# EAGLE design FETishOnAStick (EAGLE 7.4.0)
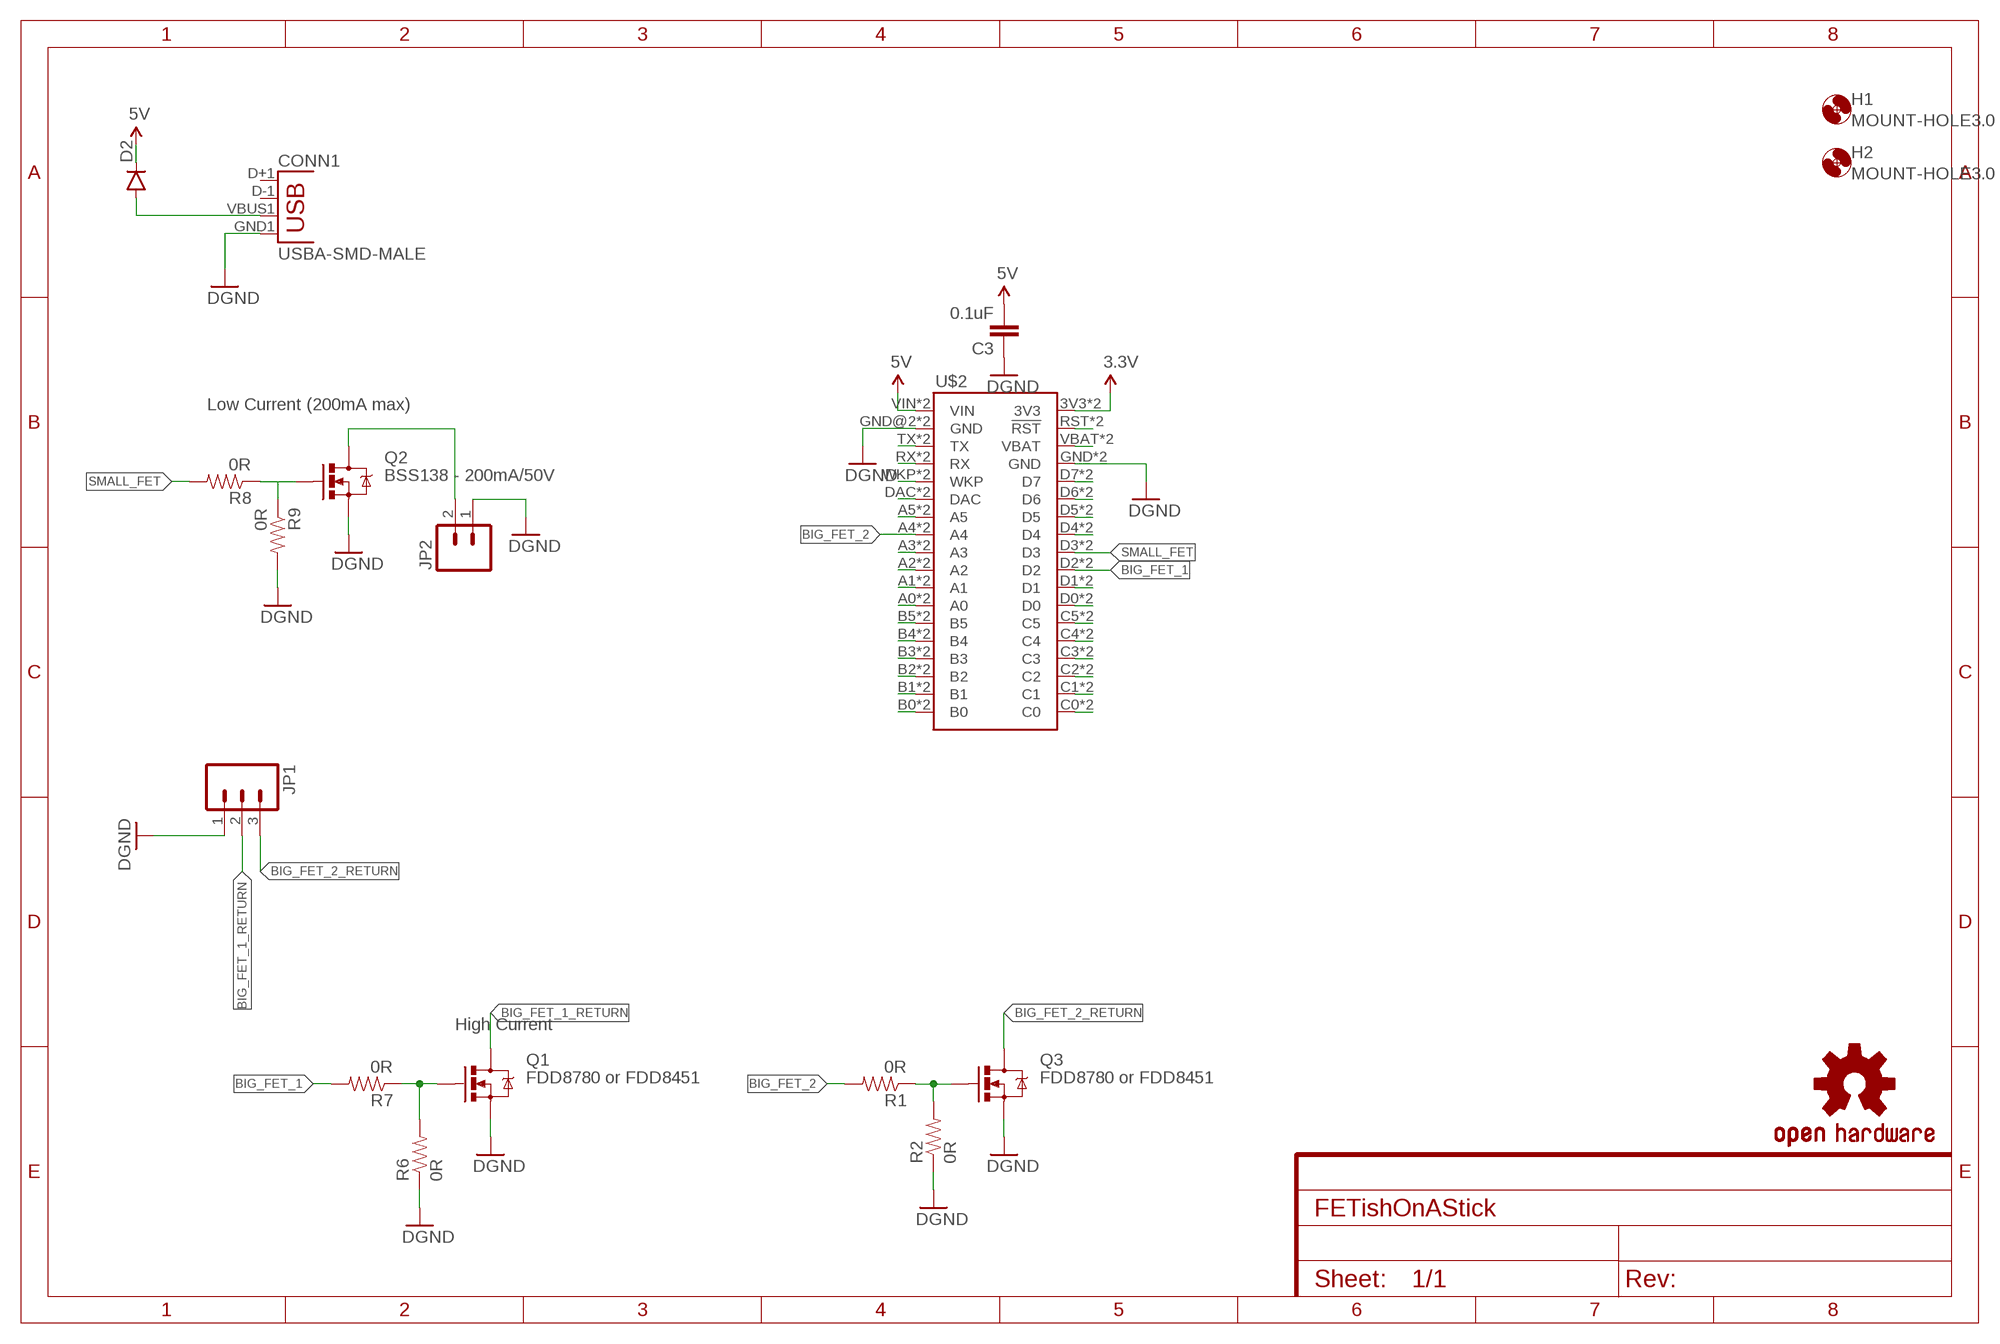
[diagram p0: schematic, sheet 1]

## Parts
C3  0.1uF  CAP0805  [0805]
CONN1  USBA-SMD-MALE  [USB-A-SMT-MALE]
D2  DIODESMA  [SMA-DIODE]
H1  MOUNT-HOLE3.0  [3,0]
H2  MOUNT-HOLE3.0  [3,0]
JP1  M03-SCREW-5MM  [SCREWTERMINAL-5MM-3]
JP2  M02POLAR  [MOLEX-1X2]
LOGO2  OSHW-LOGOS  [OSHW-LOGO-S]
Q1  FDD8780 or FDD8451  MOSFET-NCHANNELFDD8780  [DPAK]
Q2  BSS138 - 200mA/50V  MOSFET-NCHANNELBSS138  [SOT23-3]
Q3  FDD8780 or FDD8451  MOSFET-NCHANNELFDD8780  [DPAK]
R1  0R  RESISTOR0805-RES  [0805]
R2  0R  RESISTOR0805-RES  [0805]
R6  0R  RESISTOR0805-RES  [0805]
R7  0R  RESISTOR0805-RES  [0805]
R8  0R  RESISTOR0805-RES  [0805]
R9  0R  RESISTOR0805-RES  [0805]
U$2  ELECTRONDUALNAMED  [ELECTRON_SIMPLE_SILK_NAMES_DUAL]

## Nets
3.3V: U$2.3V3 U$2.3V3_1(3V3)
5V: C3.2 D2.C U$2.VIN U$2.VIN_1B(VIN)
BIG_FET_1: R7.2 U$2.D2 U$2.D2_1(D2)
BIG_FET_1_RETURN: JP1.2 Q1.4(D)
BIG_FET_2: R1.2 U$2.A4 U$2.A4_1(A4)
BIG_FET_2_RETURN: JP1.3 Q3.4(D)
GND: C3.1 CONN1.GND1(GND) JP1.1 JP2.1 Q1.3(S) Q2.2(S) Q3.3(S) R2.1 R6.1 R9.2 U$2.GND U$2.GND@2(GND) U$2.GND_1(GND) U$2.GND_1B(GND) ; supply symbol labelled DGND
N$1: CONN1.VBUS1(VBUS) D2.A
N$3: Q3.1(G) R1.1 R2.2
N$6: U$2.VBAT U$2.VBATT_1(VBAT)
N$7: U$2.RST(!RST) U$2.RST_1(!RST)
N$11: U$2.D7 U$2.D7_1(D7)
N$13: Q2.1(G) R8.1 R9.1
N$15: U$2.D6 U$2.D6_1(D6)
N$16: U$2.D5 U$2.D5_1(D5)
N$20: U$2.D4 U$2.D4_1(D4)
N$23: U$2.C5 U$2.C5_1(C5)
N$24: U$2.C4 U$2.C4_1(C4)
N$25: U$2.C3 U$2.C3_1(C3)
N$26: U$2.C2 U$2.C2_1(C2)
N$27: Q1.1(G) R6.2 R7.1
N$28: U$2.C1 U$2.C1_1(C1)
N$29: U$2.C0 U$2.C0_1(C0)
N$31: U$2.B0 U$2.B0_1(B0)
N$33: U$2.B1 U$2.B1_1(B1)
N$35: U$2.B2 U$2.B2_1(B2)
N$36: U$2.B3 U$2.B3_1(B3)
N$37: U$2.B4 U$2.B4_1(B4)
N$38: U$2.B5 U$2.B5_1(B5)
N$39: U$2.A0 U$2.A0_1(A0)
N$40: U$2.A1 U$2.A1_1(A1)
N$41: U$2.A2 U$2.A2_1(A2)
N$42: U$2.A3 U$2.A3_1(A3)
N$44: U$2.A5 U$2.A5_1(A5)
N$45: U$2.DAC U$2.DAC_1(DAC)
N$46: U$2.WKP U$2.WKP_1(WKP)
N$47: U$2.RX U$2.RX_1(RX)
N$48: U$2.TX U$2.TX_1(TX)
SCL: U$2.D1 U$2.D1_1(D1)
SDA: U$2.D0 U$2.D0_1(D0)
SMALL_FET: R8.2 U$2.D3 U$2.D3_1(D3)
SMALL_FET_RETURN: JP2.2 Q2.3(D)
Unconnected: CONN1.D+1(D+) CONN1.D-1(D-)

## Notes on the sheet
- Low Current (200mA max)
- High Current

## Library data of the parts
C3 = SparkFun-Passives:CAP: Capacitor Standard 0603 ceramic capacitor, and 0.1" leaded capacitor.
CONN1 = SparkFun-Connectors:USB: USB Connectors USB-B-PTH is fully proven SKU : PRT-00139/CONN-08278 USB-miniB is fully proven SKU : PRT-00587 USB-A-PCB is untested. USB-A-H is throughly reviewed, but untested. Spark Fun Electronics SKU : PRT-00437 USB-B-SMT is throughly reviewed, but untested. Needs silkscreen touching up. USB-A-S has not been used/tested USB-MB-H has not been used/tested USB-MICROB has been used. CONN-09505
D2 = SparkFun-DiscreteSemi:DIODE: Diode These are standard reverse protection diodes and small signal diodes. SMA package can handle up to about 1A. SOD-323 can handle about 200mA. What the SOD-323 package when ordering, there are some mfgs out there that are 5-pin packages.
H1 H2 = holes:MOUNT-HOLE: MOUNTING HOLE with drill center marker
JP1 = SparkFun-Connectors:M03: Header 3 Standard 3-pin 0.1" header. Use with straight break away headers (SKU : PRT-00116), right angle break away headers (PRT-00553), swiss pins (PRT-00743), machine pins (PRT-00117), and female headers (PRT-00115). Molex polarized connector foot print use with SKU : PRT-08232 with associated crimp pins and housings.; STOREFRONT_ID: PRT-08433
JP2 = SparkFun-Connectors:M02: Standard 2-pin 0.1" header. Use with - straight break away headers ( PRT-00116) - right angle break away headers (PRT-00553) - swiss pins (PRT-00743) - machine pins (PRT-00117) - female headers (PRT-00115) Molex polarized connector foot print use with: PRT-08233 with associated crimp pins and housings. 2.54_SCREWTERM for use with PRT-10571. 3.5mm Screw Terminal footprints for PRT-08084 5mm Screw Terminal footprints for use with PRT-08432
LOGO2 = SparkFun-Aesthetics:OSHW-LOGO: Open Source Hardware Logo This logo indicates the piece of hardware it is found on incorporates a OSHW license and/or adheres to the definition of open source hardware found here: http://freedomdefined.org/OSHW
Q1 Q3 = SparkFun-DiscreteSemi:MOSFET-NCHANNEL: Common NMOSFET Parts MFG P/N Store ID Prod ID FDD8780 TRANS-09984 SI7820DN TRANS-11055 FDS6630A IC-08089 2N7002PW TRANS-11151 FQP30N06L COM-10213 TRANS-10060 BSS123LT1G TRANS-08345 BSS138 TRANS-00830 BS170 2N7000; PROD_ID: TRANS-09984
Q2 = SparkFun-DiscreteSemi:MOSFET-NCHANNEL: Common NMOSFET Parts MFG P/N Store ID Prod ID FDD8780 TRANS-09984 SI7820DN TRANS-11055 FDS6630A IC-08089 2N7002PW TRANS-11151 FQP30N06L COM-10213 TRANS-10060 BSS123LT1G TRANS-08345 BSS138 TRANS-00830 BS170 2N7000; PROD_ID: TRANS-00830; VALUE: 200mA/50V
R1 R2 R6-R9 = SparkFun-Resistors:RESISTOR: Resistor Basic schematic elements and footprints for 0603, 1206, and PTH resistors.
U$2 = Tinamous:ELECTRON

## Board
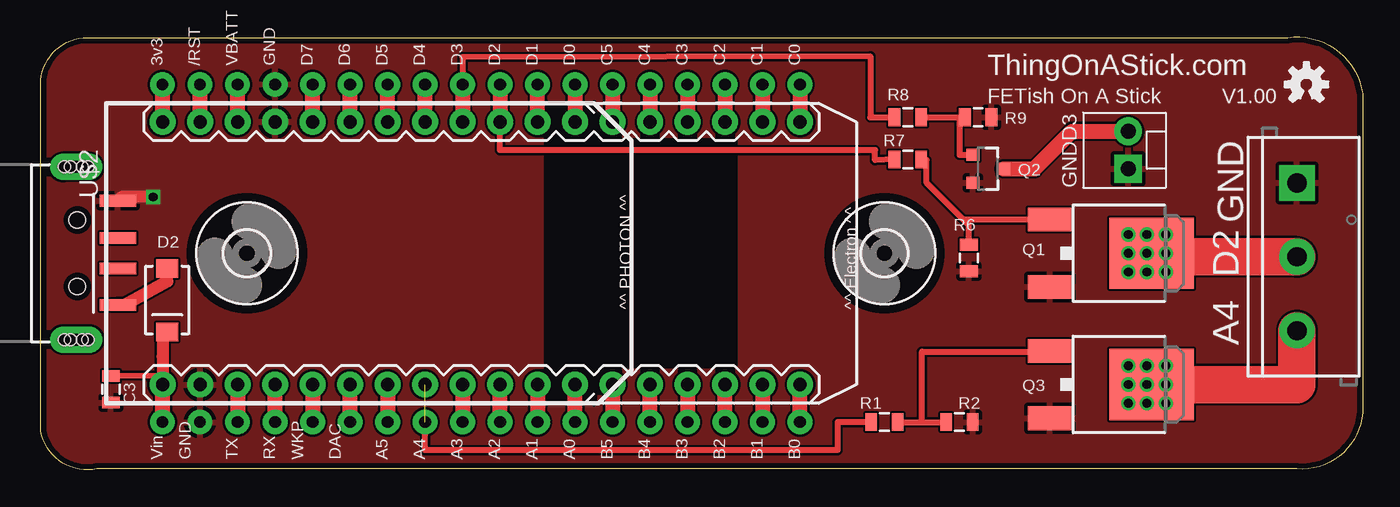
[diagram p1: board, top side]
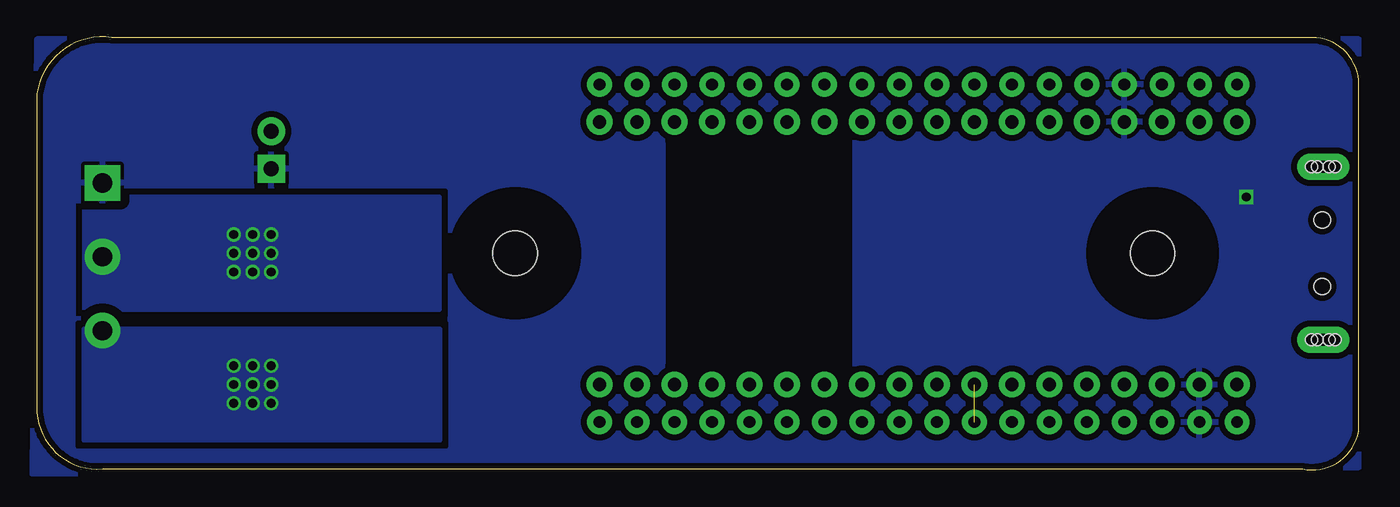
[diagram p2: board, bottom side, seen from below]

Size 89.54 x 29.31 mm. Coordinates in mm from the lower left corner, seen from the top.
Outline: 3.17,29.27 84.45,29.27 arc-90 89.54,25.46 89.54,3.87 arc-90 85.09,0.06 3.81,0.06 arc-90 0,2.6 0,26.1 arc-90 3.17,29.27
Copper layers (1*16): Top 0.0356mm / dielectric 1.5011mm / Bottom 0.0356mm
Design rules "OSHPark": minimum track width 6mil, minimum drill 13mil, track to track 6mil, track to pad 6mil, pad to pad 6mil, via to via 6mil, smd to smd 6mil, copper to edge 15mil, drill to drill 6mil, minimum pad ring 7mil, minimum via ring 7mil, stop-mask expansion 3mil, vias tented up to drill 0mil, thermal gap 10mil
tRestrict: area 34.3,4.5 to 47,24.8
bRestrict: area 34.9,4.5 to 46.4,24.8

### Footprints (pad centres in the part's own frame; a part is rotated, then mirrored left to right if it is on the bottom)
0805 = smd 0.8 x 1.2: 1 -0.9,0; 2 0.9,0
USB-A-SMT-MALE = smd 0.8 x 2.5: D+1 1.027,-5.87; D-1 -1.027,-5.87; GND1 3.551,-5.87; VBUS1 -3.5,-5.87 | drill 0.8 pad 1.778 long: P$1 5.85,-3.05; P$3 -5.85,-3.05 | hole 1.1: 2.25,-3.12; -2.25,-3.12 | hole 0.8: -5.85,-3.45; -5.85,-3.85; -5.85,-2.65; -5.85,-2.25; 5.85,-3.45; 5.85,-3.85; 5.85,-2.65; 5.85,-2.25
SMA-DIODE = smd 1.27 x 1.47: A -2.15,0; C 2.15,0
3,0 = hole 3: 0,0
SCREWTERMINAL-5MM-3 = drill 1.3 pad 2.413 square: 1 0,0 | drill 1.3 pad 2.413: 2 5,0; 3 10,0
MOLEX-1X2 = drill 1.016 pad 1.88 square: 1 0,0 | drill 1.016 pad 1.88: 2 2.54,0
DPAK = smd 1.6 x 3: 1 -2.28,-5.31; 3 2.28,-5.31 | smd 4.826 x 5.715: 4 0,1.588
SOT23-3 = smd 0.8 x 0.9: 1 -0.95,-1; 2 0.95,-1; 3 0,1.1
ELECTRON_SIMPLE_SILK_NAMES_DUAL = drill 0.889 pad 1.753: 3V3 1.27,22.86; A0 29.21,5.08; A1 26.67,5.08; A2 24.13,5.08; A3 21.59,5.08; A4 19.05,5.08; A5 16.51,5.08; B0 44.45,5.08; B1 41.91,5.08; B2 39.37,5.08; B3 36.83,5.08; B4 34.29,5.08; B5 31.75,5.08; C0 44.45,22.86; C1 41.91,22.86; C2 39.37,22.86; C3 36.83,22.86; C4 34.29,22.86; C5 31.75,22.86; D0 29.21,22.86; D1 26.67,22.86; D2 24.13,22.86; D3 21.59,22.86; D4 19.05,22.86; D5 16.51,22.86; D6 13.97,22.86; D7 11.43,22.86; DAC 13.97,5.08; GND 8.89,22.86; GND@2 3.81,5.08; RST 3.81,22.86; RX 8.89,5.08; TX 6.35,5.08; VBAT 6.35,22.86; VIN 1.27,5.08; WKP 11.43,5.08 | drill 0.8 pad 1.676: 3V3_1 1.27,25.4; A0_1 29.21,2.54; A1_1 26.67,2.54; A2_1 24.13,2.54; A3_1 21.59,2.54; A4_1 19.05,2.54; A5_1 16.51,2.54; B0_1 44.45,2.54; B1_1 41.91,2.54; B2_1 39.37,2.54; B3_1 36.83,2.54; B4_1 34.29,2.54; B5_1 31.75,2.54; C0_1 44.45,25.4; C1_1 41.91,25.4; C2_1 39.37,25.4; C3_1 36.83,25.4; C4_1 34.29,25.4; C5_1 31.75,25.4; D0_1 29.21,25.4; D1_1 26.67,25.4; D2_1 24.13,25.4; D3_1 21.59,25.4; D4_1 19.05,25.4; D5_1 16.51,25.4; D6_1 13.97,25.4; D7_1 11.43,25.4; DAC_1 13.97,2.54; GND_1 8.89,25.4; GND_1B 3.81,2.54; RST_1 3.81,25.4; RX_1 8.89,2.54; TX_1 6.35,2.54; VBATT_1 6.35,25.4; VIN_1B 1.27,2.54; WKP_1 11.43,2.54

### Placement (x,y rotation side)
C3  4.76,5.46 90 top
CONN1  -0.63,14.67 90 top
D2  8.57,11.49 270 top
H1  13.97,14.67 0 top
H2  57.15,14.67 0 top
JP1  85.09,19.43 270 top
JP2  73.66,20.38 90 top
LOGO2  85.73,26.1 0 top
Q1  73.66,14.67 270 top
Q2  64.14,20.38 270 top
Q3  73.66,5.78 270 top
R1  57.15,3.24 180 top
R2  62.23,3.24 180 top
R6  62.87,14.35 90 top
R7  58.74,21.02 180 top
R8  58.74,23.88 180 top
R9  63.5,23.88 0 top
U$2  6.99,0.7 0 top

### Tracks (layer width: path | path; a pad name or v marks a point on that pad's centre or on a via)
3.3V
  Top 1.016: U$2.3V3 U$2.3V3_1
5V
  Top 0.406: C3.2 8.26,6.41
  Top 0.813: U$2.VIN 8.26,6.41 8.26,7.68 8.26,9.34 D2.C
  Top 1.016: U$2.VIN_1B U$2.VIN
BIG_FET_1
  Top 0.406: R7.2 56.51,20.96 56.51,21.65 31.11,21.65 U$2.D2
  Top 1.016: U$2.D2_1 U$2.D2
BIG_FET_1_RETURN  (via drill 0.6)
  Top 0.406: v76.2,14.67 Q1.4
  Top 2.54: JP1.2 76.2,14.43 v76.2,14.67
  other vias: 73.66,14.67 74.93,14.67 73.66,13.4 74.93,13.4 73.66,15.94 74.93,15.94 76.2,15.94 76.2,13.4
  pour Bottom (isolate 0.61, no thermals): 62.23,18.48 86.36,18.48 86.36,10.86 62.23,10.86
BIG_FET_2  (1 unrouted)
  Top 0.406: R1.2 53.98,3.24 53.98,1.33 26.03,1.33 U$2.A4_1
BIG_FET_2_RETURN  (via drill 0.6)
  Top 2.54: JP1.3 85.09,5.78 Q3.4
  other vias: 73.66,7.05 74.93,7.05 73.66,5.78 74.93,5.78 73.66,4.51 74.93,4.51 76.2,7.05 76.2,5.78 76.2,4.51
  pour Bottom (isolate 0.61, no thermals): 62.23,9.59 62.23,1.97 86.36,1.97 86.36,9.59
GND  (via drill 0.6)
  Top 0.813: v7.62,18.48 5.49,18.48 CONN1.GND1
  pour Bottom (isolate 0.406, rank 6): 0,29.15 89.54,29.15 89.85,-0.25 40,0.06 36.58,-0.13 0,0.19
  pour Top (rank 6): 0,29.27 89.54,29.27 89.85,-0.25 0,0.06
N$1
  Top 0.813: CONN1.VBUS1 5.71,11.17 8.57,12.76 D2.A
N$3
  Top 0.406: 59.69,3.24 R2.2 | R1.1 59.69,3.24 | 59.69,3.24 59.69,8 68.35,8 Q3.1
N$6
  Top 1.016: U$2.VBAT U$2.VBATT_1
N$7
  Top 1.016: U$2.RST U$2.RST_1
N$11
  Top 1.016: U$2.D7 U$2.D7_1
N$13
  Top 0.406: R8.1 R9.1 62.23,23.87 62.23,21.33 Q2.1
N$15
  Top 1.016: U$2.D6 U$2.D6_1
N$16
  Top 1.016: U$2.D5 U$2.D5_1
N$20
  Top 1.016: U$2.D4 U$2.D4_1
N$23
  Top 1.016: U$2.C5_1 U$2.C5
N$24
  Top 1.016: U$2.C4_1 U$2.C4
N$25
  Top 1.016: U$2.C3_1 U$2.C3
N$26
  Top 1.016: U$2.C2_1 U$2.C2
N$27
  Top 0.406: Q1.1 62.49,16.95 | 62.49,16.95 60.01,19.43 60.01,20.96 R7.1 | R6.2 62.87,16.57 62.49,16.95
N$28
  Top 1.016: U$2.C1_1 U$2.C1
N$29
  Top 1.016: U$2.C0_1 U$2.C0
N$31
  Top 1.016: U$2.B0_1 U$2.B0
N$33
  Top 1.016: U$2.B1 U$2.B1_1
N$35
  Top 1.016: U$2.B2_1 U$2.B2
N$36
  Top 1.016: U$2.B3 U$2.B3_1
N$37
  Top 1.016: U$2.B4_1 U$2.B4
N$38
  Top 1.016: U$2.B5 U$2.B5_1
N$39
  Top 1.016: U$2.A0_1 U$2.A0
N$40
  Top 1.016: U$2.A1 U$2.A1_1
N$41
  Top 1.016: U$2.A2_1 U$2.A2
N$42
  Top 1.016: U$2.A3 U$2.A3_1
N$44
  Top 1.016: U$2.A5 U$2.A5_1
N$45
  Top 1.016: U$2.DAC_1 U$2.DAC
N$46
  Top 1.016: U$2.WKP U$2.WKP_1
N$47
  Top 1.016: U$2.RX_1 U$2.RX
N$48
  Top 1.016: U$2.TX U$2.TX_1
SCL
  Top 1.016: U$2.D1 U$2.D1_1
SDA
  Top 1.016: U$2.D0_1 U$2.D0
SMALL_FET
  Top 0.406: U$2.D3_1 28.57,27.95 56.2,28 56.2,23.87 R8.2
  Top 1.016: U$2.D3_1 U$2.D3
SMALL_FET_RETURN
  Top 1.016: Q2.3 67.31,20.38 69.85,22.92 JP2.2

### Text on the board
tNames: ThingOnAStick.com | FETish On A Stick | V1.00 | D3 | GND | GND | D2 | A4 | ^^ PHOTON ^^ | ^^ Electron ^^